# EAGLE design SolarController (EAGLE 9.5.2)
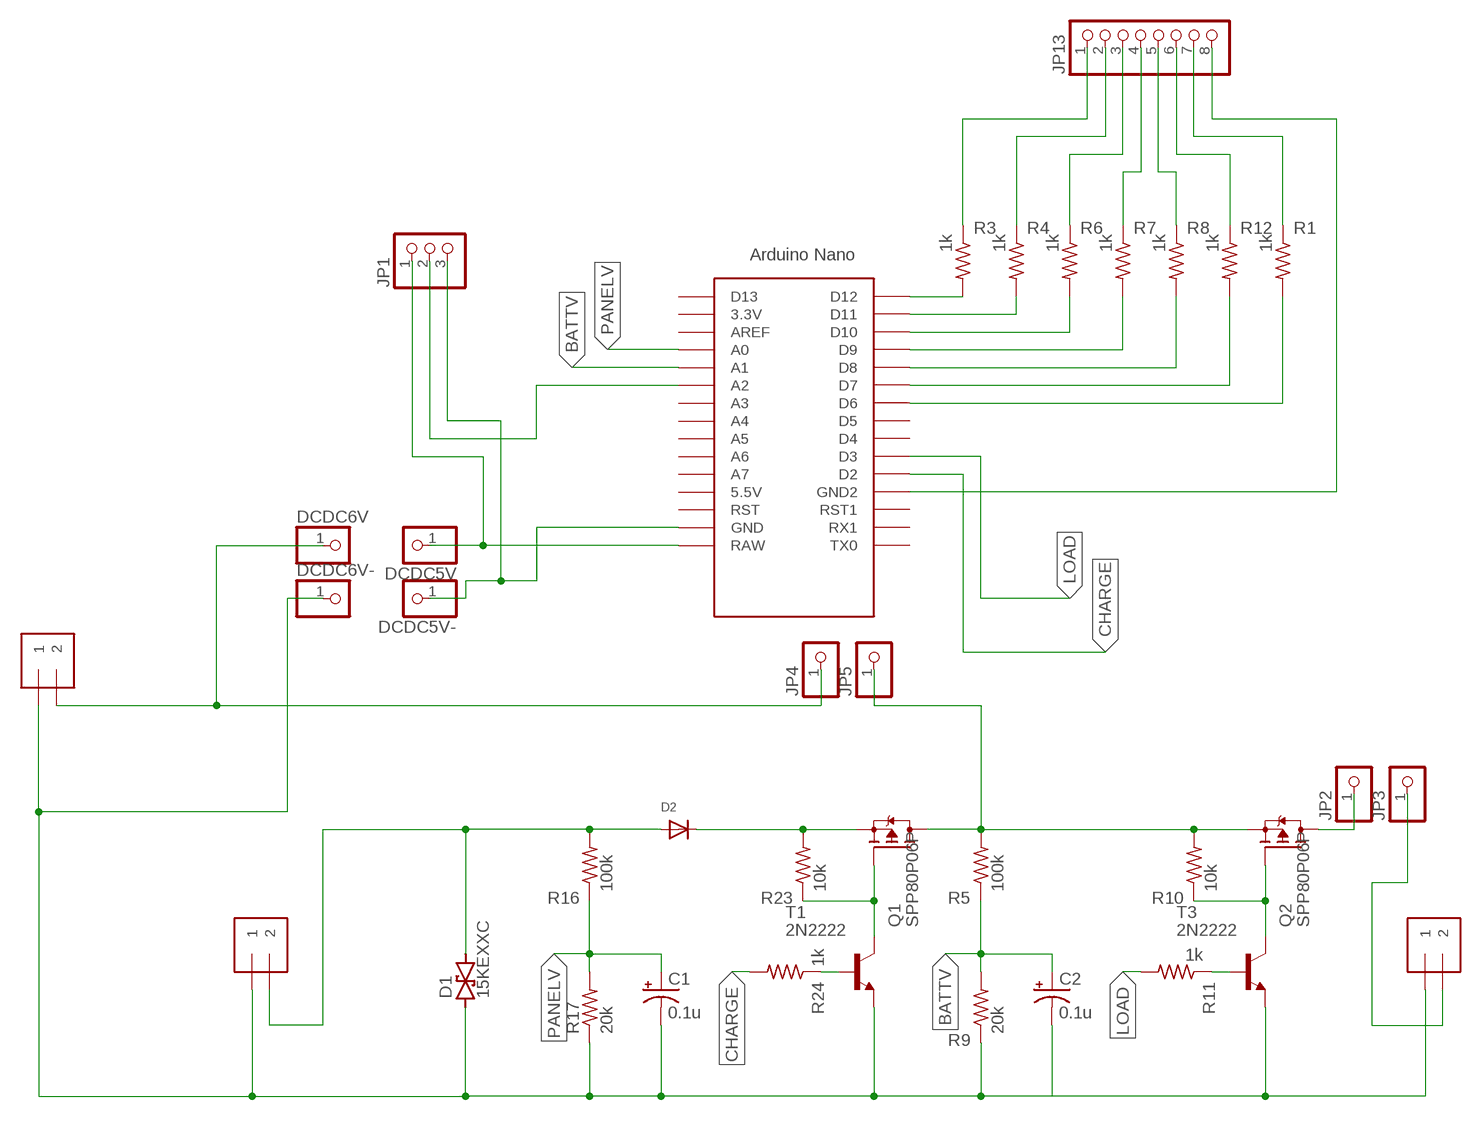
[diagram p0: schematic, sheet 1]

## Parts
BATTERY  1X2-3.5MM  [1X2-3.5MM]
C1  0.1u  CPOL-USB45181B  [B45181B]
C2  0.1u  CPOL-USB45181B  [B45181B]
D1  15KEXXC  [CB429-17]
D2  DIODEDO-1N4148  [DO-1N4148]
DCDC5V  PINHD-1X1CB  [1X01-CLEANBIG]
DCDC5V-  PINHD-1X1CB  [1X01-CLEANBIG]
DCDC6V  PINHD-1X1CB  [1X01-CLEANBIG]
DCDC6V-  PINHD-1X1CB  [1X01-CLEANBIG]
JP1  PINHD-1X3CB  [1X03-CLEANBIG]
JP2  PINHD-1X1CB  [1X01-CLEANBIG]
JP3  PINHD-1X1CB  [1X01-CLEANBIG]
JP4  PINHD-1X1CB  [1X01-CLEANBIG]
JP5  PINHD-1X1CB  [1X01-CLEANBIG]
JP13  PINHD-1X8BIG  [1X08-BIG]
LOAD  1X2-3.5MM  [1X2-3.5MM]
PANEL  1X2-3.5MM  [1X2-3.5MM]
Q1  SPP80P06P  [TO220]
Q2  SPP80P06P  [TO220]
R1  1k  R-US_0207/9  [0207/9]
R3  1k  R-US_0207/9  [0207/9]
R4  1k  R-US_0207/9  [0207/9]
R5  100k  R-US_0207/9  [0207/9]
R6  1k  R-US_0207/9  [0207/9]
R7  1k  R-US_0207/9  [0207/9]
R8  1k  R-US_0207/9  [0207/9]
R9  20k  R-US_0207/9  [0207/9]
R10  10k  R-US_0207/9  [0207/9]
R11  1k  R-US_0207/9  [0207/9]
R12  1k  R-US_0207/9  [0207/9]
R16  100k  R-US_0207/9  [0207/9]
R17  20k  R-US_0207/9  [0207/9]
R23  10k  R-US_0207/9  [0207/9]
R24  1k  R-US_0207/9  [0207/9]
T1  2N2222  [TO92-EBC-OVAL]
T3  2N2222  [TO92-EBC-OVAL]
U$1  NANO  [NANO]

## Nets
BATTV: C2.+ R5.1 R9.2 U$1.A1
CHARGE: R24.2 U$1.D2
GND: BATTERY.1 C1.- C2.- D1.A DCDC6V-.1 LOAD.1 PANEL.1 R9.1 R17.1 T1.E T3.E
LOAD: R11.2 U$1.D3
N$1: BATTERY.2 DCDC6V.1 JP4.1
N$2: U$1.A0
N$3: DCDC5V-.1 JP1.3 U$1.GND
N$4: JP3.1 LOAD.2
N$5: JP2.1 Q2.2(D)
N$6: D1.C D2.A PANEL.2 R16.2
N$7: JP13.1 R3.1
N$8: D2.C Q1.3(S) R23.2
N$9: Q1.1(G) R23.1 T1.C
N$10: R24.1 T1.B
N$11: JP5.1 Q1.2(D) Q2.3(S) R5.2 R10.2
N$12: JP1.2 U$1.A2
N$13: Q2.1(G) R10.1 T3.C
N$14: R11.1 T3.B
N$15: DCDC5V.1 JP1.1 U$1.RAW
N$16: JP13.2 R4.1
N$17: JP13.3 R6.1
N$18: JP13.4 R7.1
N$19: JP13.5 R8.1
N$20: JP13.6 R12.1
N$21: JP13.7 R1.1
N$22: JP13.8 U$1.GND1(GND2)
N$23: R3.2 U$1.D12
N$24: R4.2 U$1.D11
N$25: R6.2 U$1.D10
N$26: R7.2 U$1.D9
N$27: R8.2 U$1.D8
N$28: R12.2 U$1.D7
N$29: R1.2 U$1.D6
PANELV: C1.+ R16.1 R17.2
Unconnected: U$1.3.3V U$1.5V(5.5V) U$1.A3 U$1.A4 U$1.A5 U$1.A6 U$1.A7 U$1.AREF U$1.D4 U$1.D5 U$1.D13 U$1.ICSP1 U$1.ICSP2 U$1.ICSP3 U$1.ICSP4 U$1.ICSP5 U$1.ICSP6 U$1.RST U$1.RST1 U$1.RX1 U$1.TX0

## Library data of the parts
BATTERY LOAD PANEL = adafruit:1X2: 3.5mm Terminal block http://www.ladyada.net/library/pcb/eaglelibrary.html
C1 C2 = adafruit:CPOL-US: POLARIZED CAPACITOR, American symbol
D1 = diode:15KEXXC: DIODE
D2 = adafruit:DIODE: Diode SMADIODE - SMA Surface Mount Package 20V 1A Schottky Diode Digikey: 641-1014-6-ND DO-1N4148 - Through Hole Small Current Diode SOD-123 20V 1 A (.5mV Vf) Schottky Diode - Digikey: MBRX120TPMSCT-ND SOD-323 10V 570mA (.38mV Vf, 3ns) Schottky Diode - Digikey: ZLLS410CT-ND SOD-523 30V 30mA Schottky Diode (RB751S-40TE61) - Digikey: RB751S-40TE61CT-ND SOT23-R/W - SOT23 Package (R = Solder Paste/Reflow Ovens, W = Hand-Soldering) BAT54Film 40V 300mA - Digikey: 497-7162-1-ND
DCDC5V DCDC5V- DCDC6V DCDC6V- JP2-JP5 = adafruit:PINHD-1X1: Pin header 1x1 for 0.1" spacing With round pins
JP1 = adafruit:PINHD-1X3: PIN HEADER
JP13 = adafruit:PINHD-1X8: PIN HEADER
Q1 Q2 = transistor-fet:SPP80P06P: SIPMOS(R) Power-Transistor P-Channel, Enhancement mode Source: http://www.infineon.com/upload/Document/cmc_upload/documents/012/3619/SPP80P06P.pdf
R1 R3-R12 R16 R17 R23 R24 = adafruit:R-US_: RESISTOR, American symbol
T1 T3 = adafruit:2N2222: NPN TRANSISTOR Big oval pads
U$1 = Arduino-clone:NANO: Arduino Nano

## Net classes
0 default: drill 0.127 mm

## Board
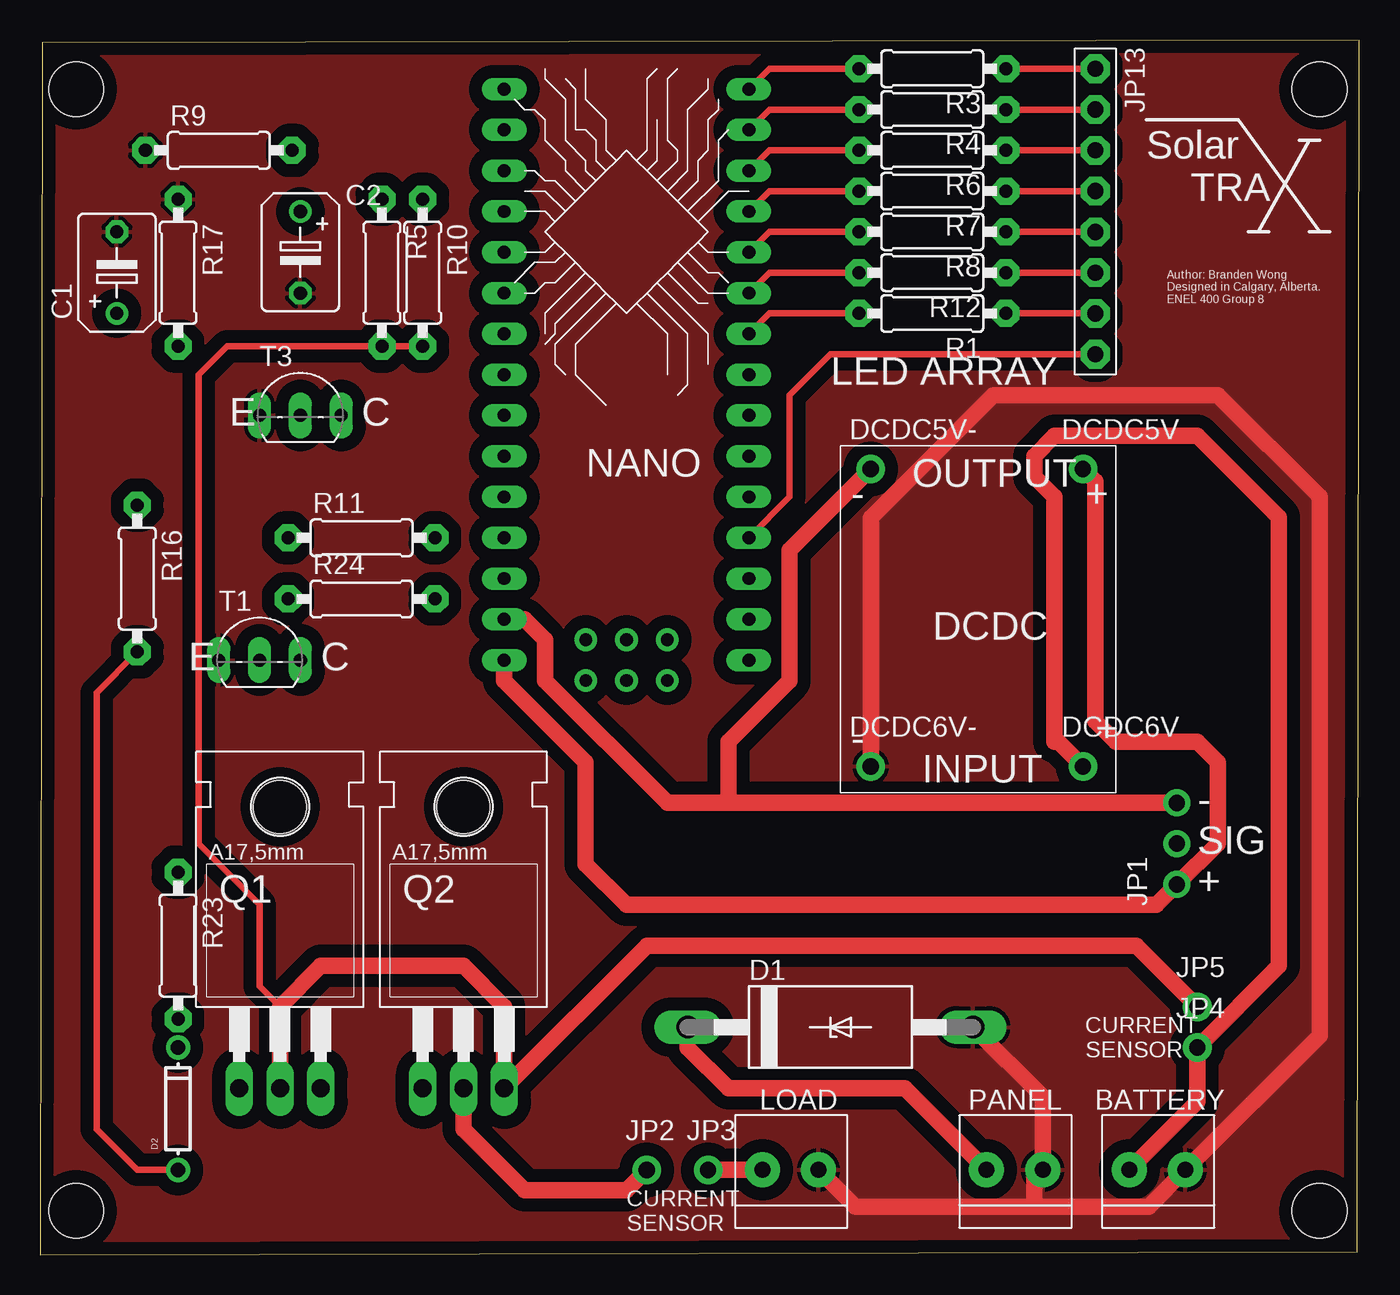
[diagram p1: board, top side]
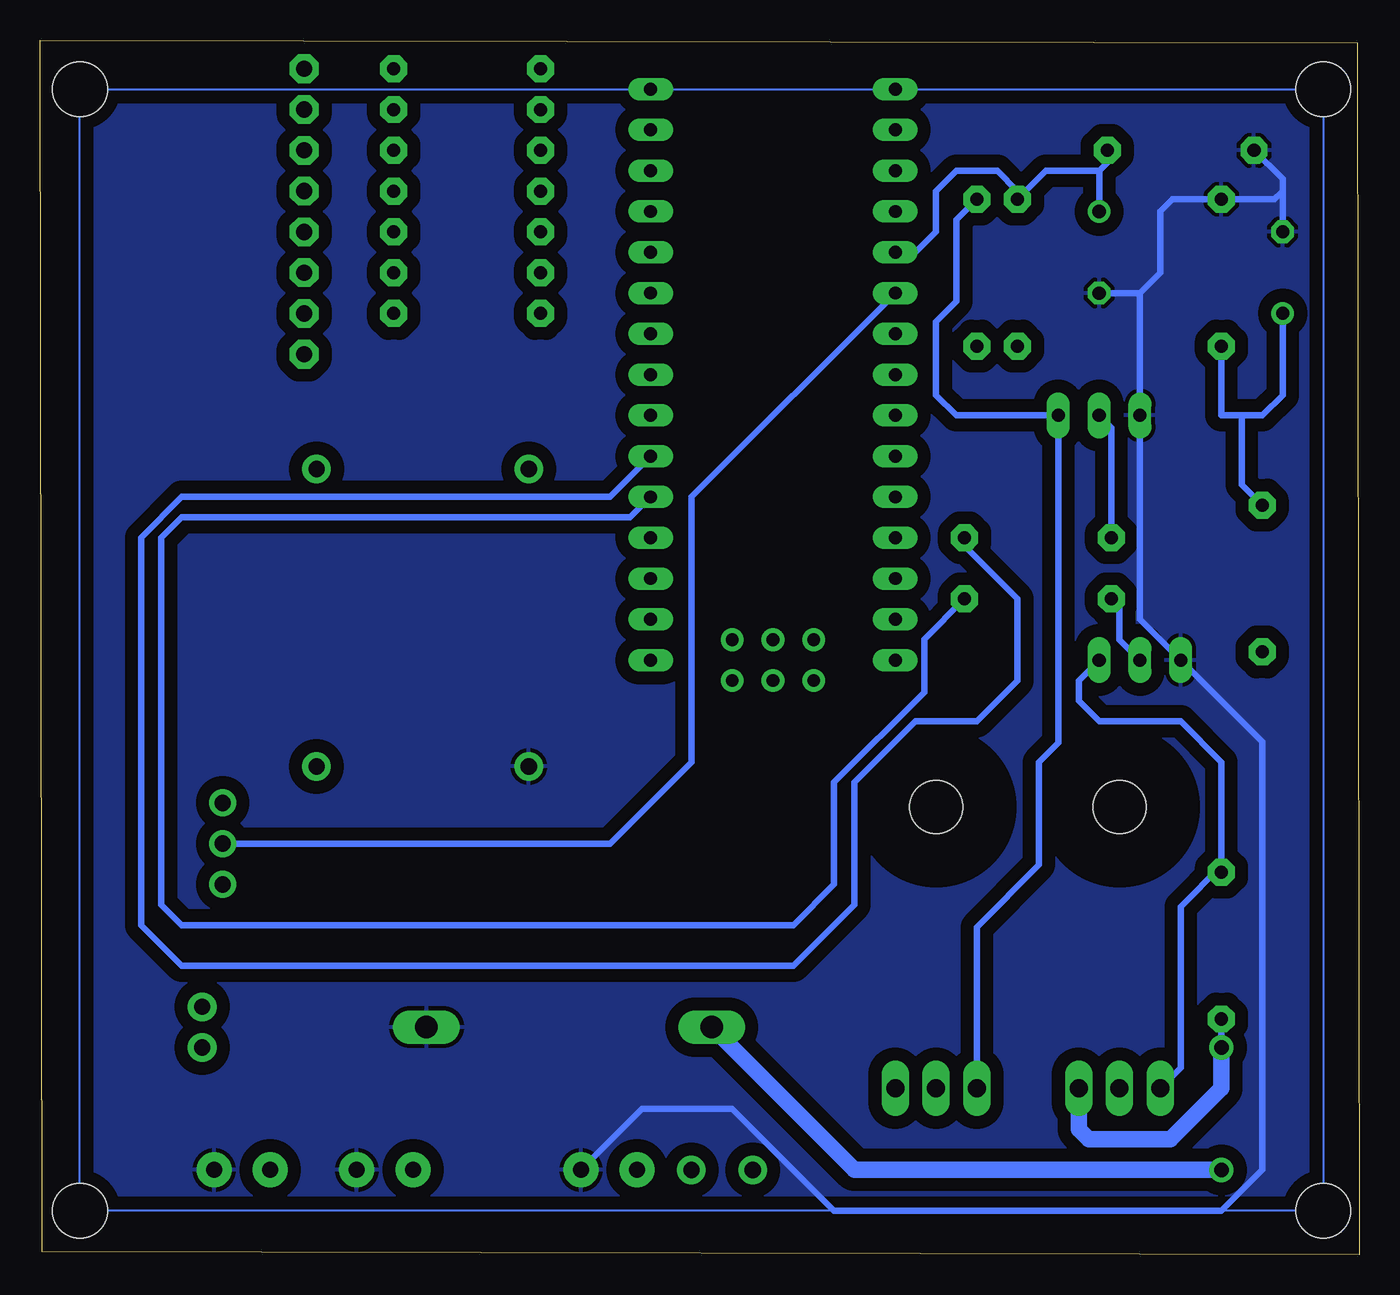
[diagram p2: board, bottom side, seen from below]

Size 82.19 x 75.64 mm. Coordinates in mm from the lower left corner, seen from the top.
Outline: 0,0 82.06,0.17 82.19,75.64 0.14,75.46 0,0
Copper layers (1*16): Top 0.035mm / dielectric 1.5mm / Bottom 0.035mm
Design rules "SparkFun": minimum track width 8mil, minimum drill 20mil, track to track 8mil, track to pad 8mil, pad to pad 8mil, via to via 8mil, smd to smd 8mil, copper to edge 8mil, drill to drill 8mil, minimum pad ring 12mil, minimum via ring 10mil, stop-mask expansion 4mil, vias tented up to drill 20mil, thermal gap 10mil
Holes 3.4 mm at 2.24,72.58 79.71,72.58 79.71,2.73 2.24,2.73

### Footprints (pad centres in the part's own frame; a part is rotated, then mirrored left to right if it is on the bottom)
1X2-3.5MM = drill 1 pad 2.184: 1 1.8,0; 2 -1.7,0
B45181B = drill 0.813: + -2.54,0 | drill 0.813 octagon: - 2.54,0
CB429-17 = drill 1.397 long: A 8.89,0; C -8.89,0
DO-1N4148 = drill 0.9: A -3.81,0; C 3.81,0
1X01-CLEANBIG = drill 1.016 pad 1.778: 1 0,0
1X03-CLEANBIG = drill 1.016 pad 1.676: 1 -2.54,0; 2 0,0; 3 2.54,0
1X08-BIG = drill 1.016 pad 1.778 octagon: 1 -8.89,0; 2 -6.35,0; 3 -3.81,0; 4 -1.27,0; 5 1.27,0; 6 3.81,0; 7 6.35,0; 8 8.89,0
TO220 = drill 1.118 long: 1 -2.54,-6.35; 2 0,-6.35; 3 2.54,-6.35 | hole 3.302: 0,11.176
0207/9 = drill 0.813 pad 1.676 octagon: 1 -4.572,0; 2 4.572,0
TO92-EBC-OVAL = drill 0.813 long: B 0,-1.27; C 2.54,-1.27; E -2.54,-1.27
NANO = drill 0.8 long: 3.3V -10.16,24.13; 5V -10.16,-1.27; A0 -10.16,19.05; A1 -10.16,16.51; A2 -10.16,13.97; A3 -10.16,11.43; A4 -10.16,8.89; A5 -10.16,6.35; A6 -10.16,3.81; A7 -10.16,1.27; AREF -10.16,21.59; D2 5.08,1.27; D3 5.08,3.81; D4 5.08,6.35; D5 5.08,8.89; D6 5.08,11.43; D7 5.08,13.97; D8 5.08,16.51; D9 5.08,19.05; D10 5.08,21.59; D11 5.08,24.13; D12 5.08,26.67; D13 -10.16,26.67; GND -10.16,-6.35; GND1 5.08,-1.27; RAW -10.16,-8.89; RST -10.16,-3.81; RST1 5.08,-3.81; RX1 5.08,-6.35; TX0 5.08,-8.89 | drill 0.8: ICSP1 -5.08,-10.16; ICSP2 -5.08,-7.62; ICSP3 -2.54,-10.16; ICSP4 -2.54,-7.62; ICSP5 0,-10.16; ICSP6 0,-7.62

### Placement (x,y rotation side)
BATTERY  69.55,5.27 0 top
C1  4.78,61.15 90 top
C2  16.21,62.42 270 top
D1  49.23,14.16 0 top
D2  8.59,9.08 90 top
DCDC5V  64.97,48.93 0 top
DCDC5V-  51.75,48.93 0 top
DCDC6V  64.97,30.41 0 top
DCDC6V-  51.75,30.41 0 top
JP1  70.82,25.59 90 top
JP2  37.8,5.27 0 top
JP3  41.61,5.27 0 top
JP4  72.09,12.89 0 top
JP5  72.09,15.43 0 top
JP13  65.74,64.96 270 top
LOAD  46.69,5.27 0 top
PANEL  60.66,5.27 0 top
Q1  14.94,16.7 0 top
Q2  26.37,16.7 0 top
R1  55.58,58.61 180 top
R3  55.58,73.85 180 top
R4  55.58,71.31 180 top
R5  21.29,61.15 270 top
R6  55.58,68.77 180 top
R7  55.58,66.23 180 top
R8  55.58,63.69 180 top
R9  11.13,68.77 0 top
R10  23.83,61.15 270 top
R11  20.02,44.64 0 top
R12  55.58,61.15 180 top
R16  6.05,42.1 270 top
R17  8.59,61.15 270 top
R23  8.59,19.24 270 top
R24  20.02,40.83 0 top
T1  13.67,38.29 0 top
T3  16.21,53.53 0 top
U$1  39.07,45.91 0 top

### Tracks (layer width: path | path; a pad name or v marks a point on that pad's centre or on a via)
BATTV
  Bottom 0.406: C2.+ 16.21,67.5 | 16.21,67.5 19.52,67.5 R5.1 21.29,66.23 22.56,67.5 25.1,67.5 26.37,66.23 26.37,63.69 27.64,62.42 U$1.A1 | 16.21,67.5 15.71,68.01 R9.2
CHARGE
  Bottom 0.406: U$1.D2 45.42,45.91 73.36,45.91 74.63,44.64 74.63,21.78 73.36,20.51 35.26,20.51 32.72,23.05 32.72,29.4 27.1,35.03 27.1,38.33 R24.2
GND
  Top 1.016: LOAD.1 50.78,2.99 61.93,2.99 | 61.93,2.99 69.07,2.99 BATTERY.1 79.71,13.63 79.71,47.18 73.36,53.53 59.39,53.53 51.75,45.89 DCDC6V-.1 | 61.93,2.99 61.93,4.74 PANEL.1 62.46,9.82 D1.A
  Bottom 0.406: LOAD.1 44.68,9.08 39.07,9.08 32.72,2.73 8.59,2.73 6.05,5.27 6.05,31.94 T1.E 13.67,39.56 T3.E 13.67,59.88 | C2.- 13.67,59.88 | C1.- 4.78,66.23 | 13.67,59.88 12.4,61.15 12.4,64.96 11.64,65.73 R17.1 5.29,65.73 4.78,66.23 | 4.78,66.23 4.78,67 R9.1
  pour Top (isolate 0.813): -0.3,75.12 -0.3,-1.08 83.52,-1.08 83.52,77.66 0.97,77.66 -0.3,76.39
  pour Bottom (isolate 0.813): -1.57,78.93 -1.57,-2.35 -0.3,-3.62 86.06,-3.62 88.6,-1.08 88.6,77.66 86.06,80.2 -0.3,80.2
LOAD
  Bottom 0.406: U$1.D3 46.69,47.18 73.36,47.18 75.9,44.64 75.9,20.51 73.36,17.97 35.26,17.97 31.45,21.78 31.45,29.4 27.64,33.21 23.83,33.21 21.29,35.75 21.29,40.83 24.6,44.14 R11.2
N$1
  Top 1.016: BATTERY.2 72.09,9.51 JP4.1 77.17,17.97 77.17,45.91 72.09,50.99 63.2,50.99 61.93,49.72 61.93,48.45 63.2,47.18 63.2,31.94 63.43,31.94 DCDC6V.1
N$3
  Top 1.016: U$1.GND 30.18,39.56 31.45,38.29 31.45,35.75 39.07,28.13 42.88,28.13 | 42.88,28.13 JP1.3 | DCDC5V-.1 46.69,43.87 46.69,35.75 42.88,31.94 42.88,28.13
N$4
  Top 1.016: JP3.1 LOAD.2
N$5
  Top 1.016: Q2.2 26.37,7.81 30.18,4 36.53,4 JP2.1
N$6
  Top 0.406: D2.A 6.05,5.27 3.51,7.81 3.51,34.99 R16.2
  Top 1.016: PANEL.2 53.88,10.35 42.88,10.35 40.34,12.89 D1.C
  Bottom 1.016: D2.A 31.45,5.27 D1.C
N$7
  Top 0.406: R3.1 JP13.1
N$8
  Bottom 0.406: R23.2 D2.C
  Bottom 1.016: D2.C 8.59,10.35 11.77,7.18 16.85,7.18 17.48,7.81 Q1.3
N$9
  Bottom 0.406: Q1.1 11.13,11.62 11.13,21.67 8.59,24.21 R23.1 8.59,30.67 11.13,33.21 16.21,33.21 17.48,34.48 17.48,35.75 T1.C
N$10
  Bottom 0.406: T1.B 14.94,38.29 14.94,40.33 R24.1
N$11
  Top 0.406: 14.94,15.43 13.67,16.7 13.67,21.78 9.86,25.59 9.86,54.8 11.64,56.58 R5.2 R10.2
  Top 1.016: Q1.2 14.94,15.43 17.48,17.97 26.37,17.97 28.91,15.43 Q2.3 37.8,19.24 68.28,19.24 JP5.1
N$12
  Bottom 0.406: JP1.2 46.69,25.59 41.61,30.67 41.61,47.18 U$1.A2
N$13
  Bottom 0.406: Q2.1 23.83,20.4 19.97,24.27 19.97,30.67 18.75,31.89 T3.C 25.1,52.26 26.37,53.53 26.37,58.11 25.1,59.38 25.1,64.46 R10.1
N$14
  Bottom 0.406: T3.B 15.45,51.5 R11.1
N$15
  Top 1.016: U$1.RAW 28.91,35.75 33.99,30.67 33.99,24.32 36.53,21.78 69.55,21.78 JP1.1 73.36,25.59 73.36,30.67 72.09,31.94 67.01,31.94 65.74,33.21 65.74,48.15 DCDC5V.1
N$16
  Top 0.406: R4.1 JP13.2
N$17
  Top 0.406: R6.1 JP13.3
N$18
  Top 0.406: JP13.4 R7.1
N$19
  Top 0.406: R8.1 JP13.5
N$20
  Top 0.406: R12.1 JP13.6
N$21
  Top 0.406: R1.1 JP13.7
N$22
  Top 0.406: JP13.8 49.23,56.07 46.69,53.53 46.69,47.18 U$1.GND1
N$23
  Top 0.406: U$1.D12 45.42,73.85 R3.2
N$24
  Top 0.406: U$1.D11 45.42,71.31 R4.2
N$25
  Top 0.406: U$1.D10 45.42,68.77 R6.2
N$26
  Top 0.406: U$1.D9 45.42,66.23 R7.2
N$27
  Top 0.406: U$1.D8 45.42,63.69 R8.2
N$28
  Top 0.406: U$1.D7 45.42,61.15 R12.2
N$29
  Top 0.406: U$1.D6 45.42,58.61 R1.2
PANELV
  Bottom 0.406: 7.32,52.26 7.32,47.95 R16.1 | R17.2 8.59,52.26 7.32,52.26 | C1.+ 4.78,53.53 6.05,52.26 7.32,52.26
(copper drawn outside any net)
  shapes: Bottom area x4

### Text on the board
tPlace: Solar / TRA | Author: Branden Wong / Designed in Calgary, Alberta. / ENEL 400 Group 8 | LED ARRAY | E | C | NANO | OUTPUT | - | + | DCDC | E | C | - | + | INPUT | - | SIG | + | CURRENT / SENSOR | CURRENT / SENSOR